# Altium schematic sheet Controller_Board_Interface.SchDoc
size Letter; Website: www.uwmidsun.com
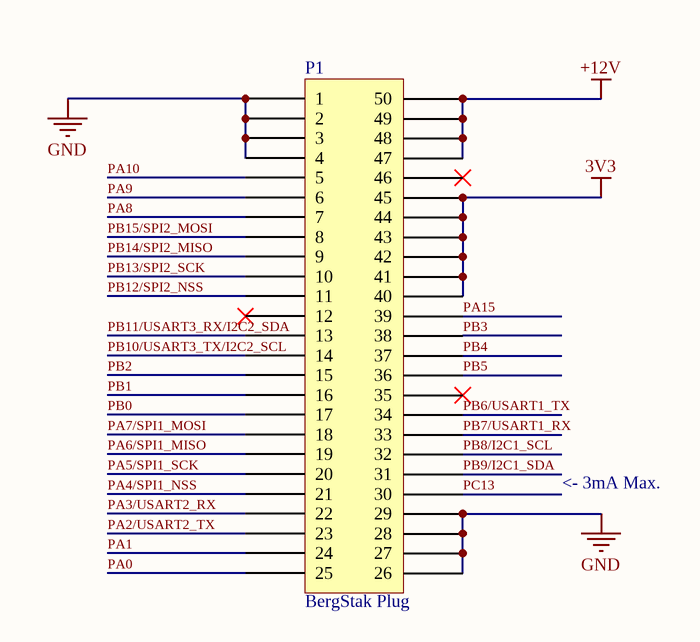
[diagram p0: Controller_Board_Interface.SchDoc]

## Parts
P1  BergStak Plug  [Bergstak 50 Pos Plug]

## Nets
3V3: P1.40 P1.41 P1.42 P1.43 P1.44 P1.45
+12V: P1.47 P1.48 P1.49 P1.50
GND: P1.1 P1.2 P1.3 P1.4 P1.26 P1.27 P1.28 P1.29
PA0: P1.25
PA1: P1.24
PA2/USART2_TX: P1.23
PA3/USART2_RX: P1.22
PA4/SPI1_NSS: P1.21
PA5/SPI1_SCK: P1.20
PA6/SPI1_MISO: P1.19
PA7/SPI1_MOSI: P1.18
PA8: P1.7
PA9: P1.6
PA10: P1.5
PA15: P1.39
PB0: P1.17
PB1: P1.16
PB2: P1.15
PB3: P1.38
PB4: P1.37
PB5: P1.36
PB6/USART1_TX: P1.34
PB7/USART1_RX: P1.33
PB8/I2C1_SCL: P1.32
PB9/I2C1_SDA: P1.31
PB10/USART3_TX/I2C2_SCL: P1.14
PB11/USART3_RX/I2C2_SDA: P1.13
PB12/SPI2_NSS: P1.11
PB13/SPI2_SCK: P1.10
PB14/SPI2_MISO: P1.9
PB15/SPI2_MOSI: P1.8
PC13: P1.30

Not connected (* = marked no-connect by the designer): P1 12* 35* 46*

## Notes on the sheet
- <- 3mA Max.
- Project:
- Title:
- Size:
- Project Lead:
- Letter
- Revision:
- University of Waterloo
- 200 University Ave W
- Waterloo, ON, Canada
- N2L 3E9
- Date:
- Sheet
- of
- Website:

## Library data of the parts
P1 = BergStak 50 Position Connector Plug: 50 Position Connector Plug, Outer Shroud Contacts Surface Mount Gold; Manufacturer PN: 10132797-055100LF; Digikey PN: 609-5226-1-ND